# EAGLE design putt_project (EAGLE 9.6.2)
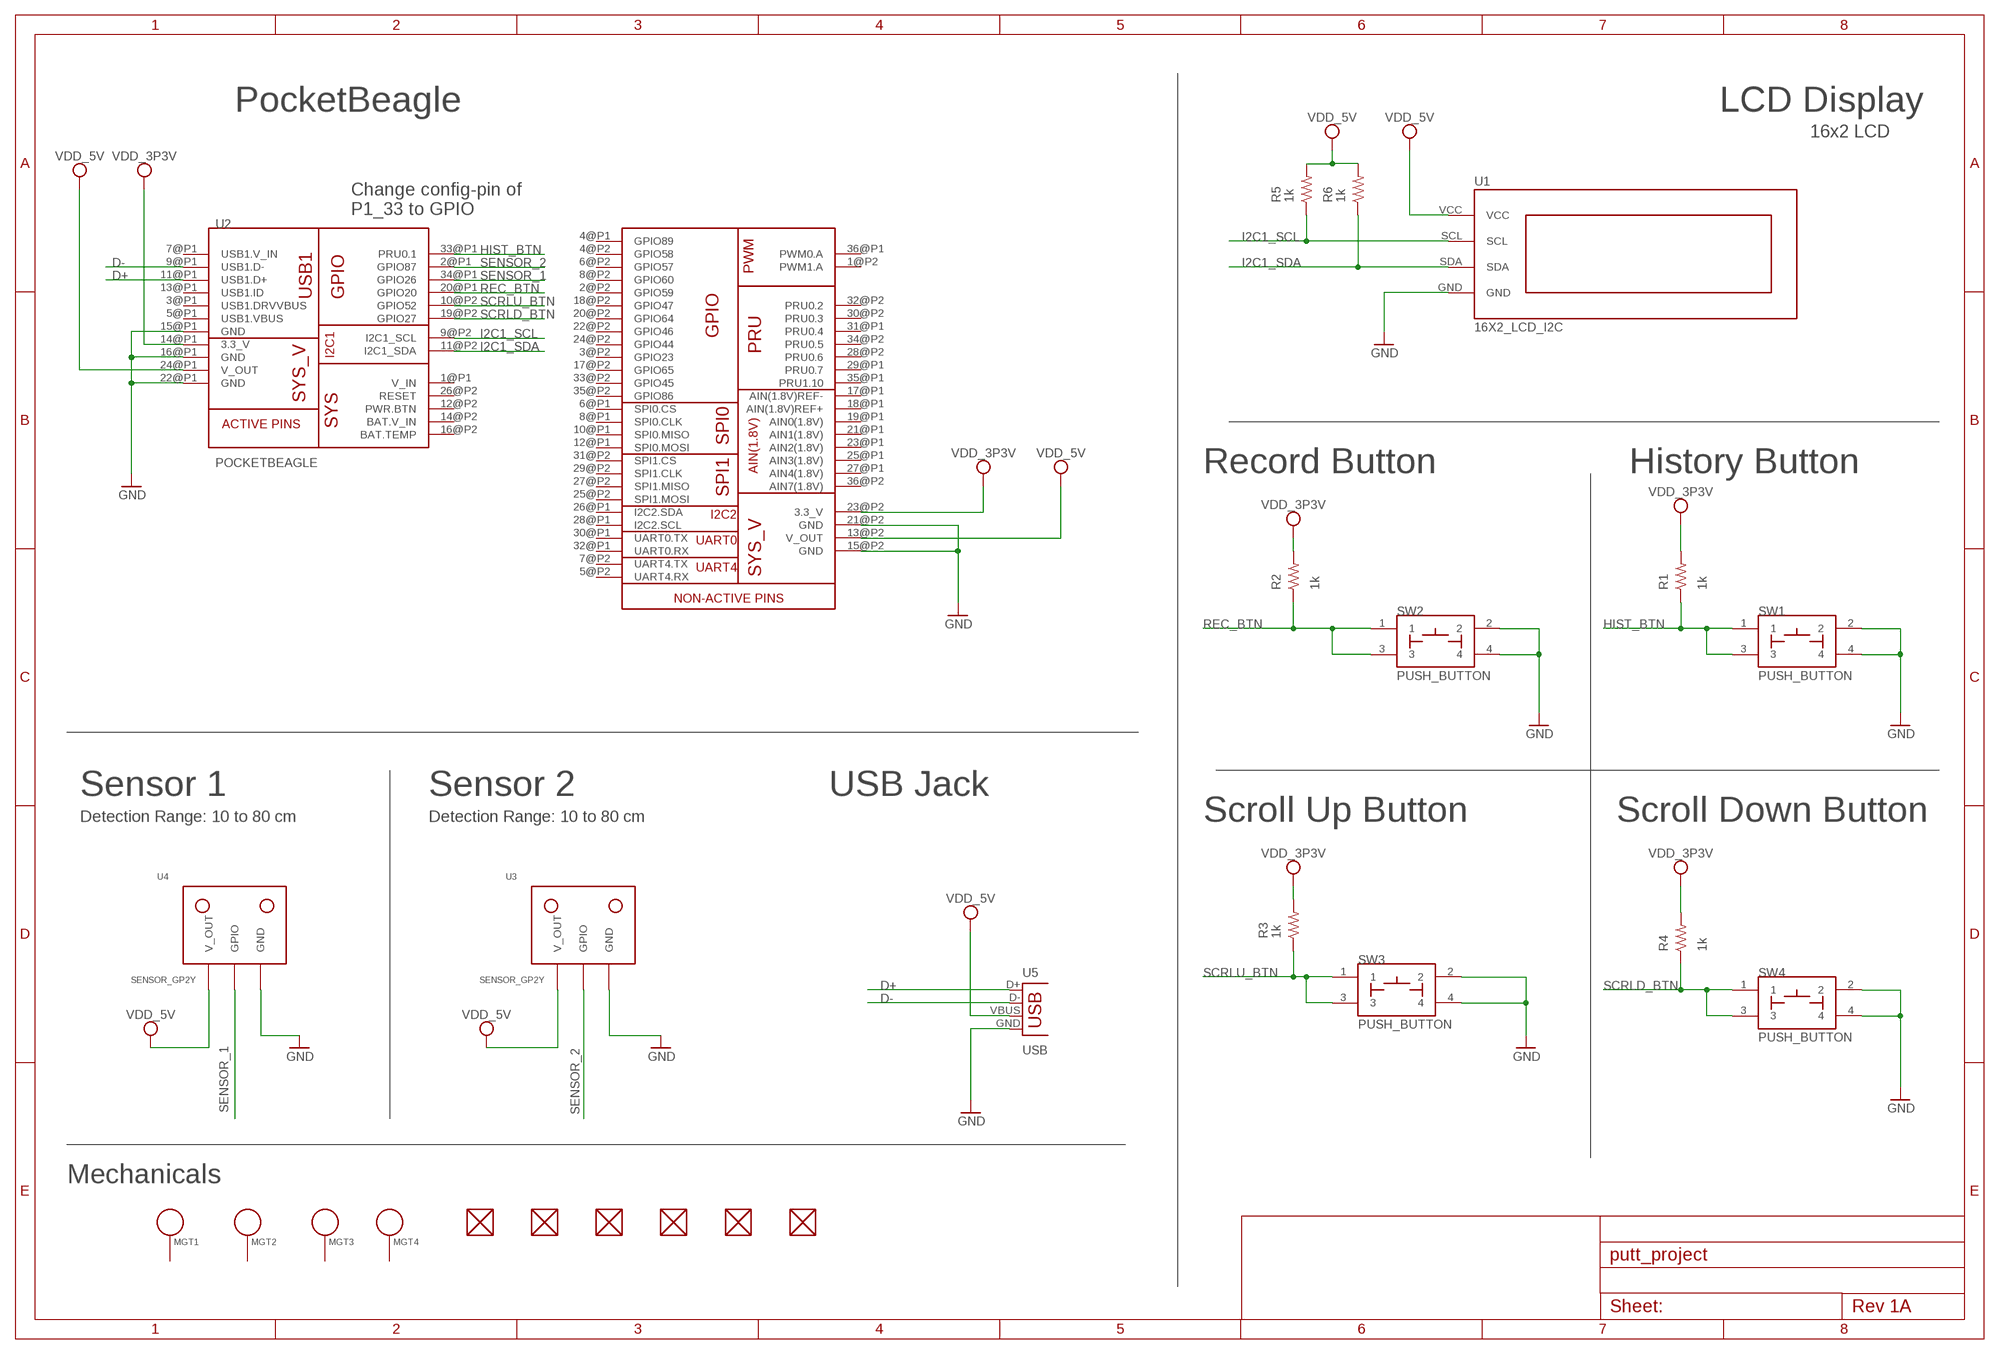
[diagram p0: schematic, sheet 1]

## Parts
FUD1  FIDUCIAL  [FIDUCIAL_40MIL]
FUD2  FIDUCIAL  [FIDUCIAL_40MIL]
FUD3  FIDUCIAL  [FIDUCIAL_40MIL]
FUD4  FIDUCIAL  [FIDUCIAL_40MIL]
FUD5  FIDUCIAL  [FIDUCIAL_40MIL]
FUD6  FIDUCIAL  [FIDUCIAL_40MIL]
MGT1  MOUNTING_HOLE  [MOUNTING_HOLE]
MGT2  MOUNTING_HOLE  [MOUNTING_HOLE]
MGT3  MOUNTING_HOLE  [MOUNTING_HOLE]
MGT4  MOUNTING_HOLE  [MOUNTING_HOLE]
R1  1k  R_R0603  [R0603]
R2  1k  R_R0603  [R0603]
R3  1k  R_R0603  [R0603]
R4  1k  R_R0603  [R0603]
R5  1k  R_R0603  [R0603]
R6  1k  R_R0603  [R0603]
SW1  PUSH_BUTTON  [BUTTON_12.5MM]
SW2  PUSH_BUTTON  [BUTTON_12.5MM]
SW3  PUSH_BUTTON  [BUTTON_12.5MM]
SW4  PUSH_BUTTON  [BUTTON_12.5MM]
U1  16X2_LCD_I2C  [16X2_LCD_I2C]
U2  POCKETBEAGLE  [POCKETBEAGLE]
U3  SENSOR_GP2Y  [SENSOR_IR]
U4  SENSOR_GP2Y  [SENSOR_IR]
U5  USB  [USB-A-H]

## Nets
D+: U2.11@P1(USB1.D+) U5.D+
D-: U2.9@P1(USB1.D-) U5.D-
GND: SW1.2 SW1.4 SW2.2 SW2.4 SW3.2 SW3.4 SW4.2 SW4.4 U1.GND U2.15@P1(GND) U2.15@P2(GND) U2.16@P1(GND) U2.21@P2(GND) U2.22@P1(GND) U3.GND U4.GND U5.GND
HIST_BTN: R1.1 SW1.1 SW1.3 U2.33@P1(PRU0.1)
I2C1_SCL: R5.1 U1.SCL U2.9@P2(I2C1_SCL)
I2C1_SDA: R6.1 U1.SDA U2.11@P2(I2C1_SDA)
REC_BTN: R2.1 SW2.1 SW2.3 U2.20@P1(GPIO20)
SCRLD_BTN: R4.1 SW4.1 SW4.3 U2.19@P2(GPIO27)
SCRLU_BTN: R3.1 SW3.1 SW3.3 U2.10@P2(GPIO52)
SENSOR_1: U2.34@P1(GPIO26) U4.GPIO
SENSOR_2: U2.2@P1(GPIO87) U3.GPIO
VDD_3P3V: R1.2 R2.2 R3.2 R4.2 U2.14@P1(3.3_V) U2.23@P2(3.3_V)
VDD_5V: R5.2 R6.2 U1.VCC U2.13@P2(V_OUT) U2.24@P1(V_OUT) U3.PWR(V_OUT) U4.PWR(V_OUT) U5.VBUS
Unconnected: FUD1.P$1 FUD2.P$1 FUD3.P$1 FUD4.P$1 FUD5.P$1 FUD6.P$1 MGT1.P$1 MGT2.P$1 MGT3.P$1 MGT4.P$1 U2.1@P1(V_IN) U2.1@P2(PWM1.A) U2.2@P2(GPIO59) U2.3@P1(USB1.DRVVBUS) U2.3@P2(GPIO23) U2.4@P1(GPIO89) U2.4@P2(GPIO58) U2.5@P1(USB1.VBUS) U2.5@P2(UART4.RX) U2.6@P1(SPI0.CS) U2.6@P2(GPIO57) U2.7@P1(USB1.V_IN) U2.7@P2(UART4.TX) U2.8@P1(SPI0.CLK) U2.8@P2(GPIO60) U2.10@P1(SPI0.MISO) U2.12@P1(SPI0.MOSI) U2.12@P2(PWR.BTN) U2.13@P1(USB1.ID) U2.14@P2(BAT.V_IN) U2.16@P2(BAT.TEMP) U2.17@P1(AIN(1.8V)REF-) U2.17@P2(GPIO65) U2.18@P1(AIN(1.8V)REF+) U2.18@P2(GPIO47) U2.19@P1(AIN0(1.8V)) U2.20@P2(GPIO64) U2.21@P1(AIN1(1.8V)) U2.22@P2(GPIO46) U2.23@P1(AIN2(1.8V)) U2.24@P2(GPIO44) U2.25@P1(AIN3(1.8V)) U2.25@P2(SPI1.MOSI) U2.26@P1(I2C2.SDA) U2.26@P2(RESET) U2.27@P1(AIN4(1.8V)) U2.27@P2(SPI1.MISO) U2.28@P1(I2C2.SCL) U2.28@P2(PRU0.6) U2.29@P1(PRU0.7) U2.29@P2(SPI1.CLK) U2.30@P1(UART0.TX) U2.30@P2(PRU0.3) U2.31@P1(PRU0.4) U2.31@P2(SPI1.CS) U2.32@P1(UART0.RX) U2.32@P2(PRU0.2) U2.33@P2(GPIO45) U2.34@P2(PRU0.5) U2.35@P1(PRU1.10) U2.35@P2(GPIO86) U2.36@P1(PWM0.A) U2.36@P2(AIN7(1.8V))

## Notes on the sheet
- PocketBeagle | LCD Display
- 16x2 LCD
- Change config-pin of 
  P1_33 to GPIO
- Record Button | History Button
- Sensor 1 | Sensor 2 | USB Jack
- Detection Range: 10 to 80 cm | Detection Range: 10 to 80 cm | Scroll Up Button | Scroll Down Button
- U5
- USB
- Mechanicals

## Library data of the parts
FUD1-FUD6 = Putt_Project:FIDUCIAL
MGT1-MGT4 = Putt_Project:MOUNTING_HOLE: Chassis Mounting Hole w/GND connection ability
R1-R6 = Putt_Project:R_: RESISTOR, American symbol
SW1-SW4 = Putt_Project:PUSH_BUTTON
U1 = Putt_Project:16X2_LCD_I2C: 0.56" LED HEX Backback - Adafruit HT16K33 - https://www.adafruit.com/product/878 - https://www.adafruit.com/product/879 - https://www.adafruit.com/product/880 - https://www.adafruit.com/product/881 - https://www.adafruit.com/product/1002
U2 = Putt_Project:POCKETBEAGLE
U3 U4 = Putt_Project:SENSOR_GP2Y
U5 = Putt_Project:USB

## Board
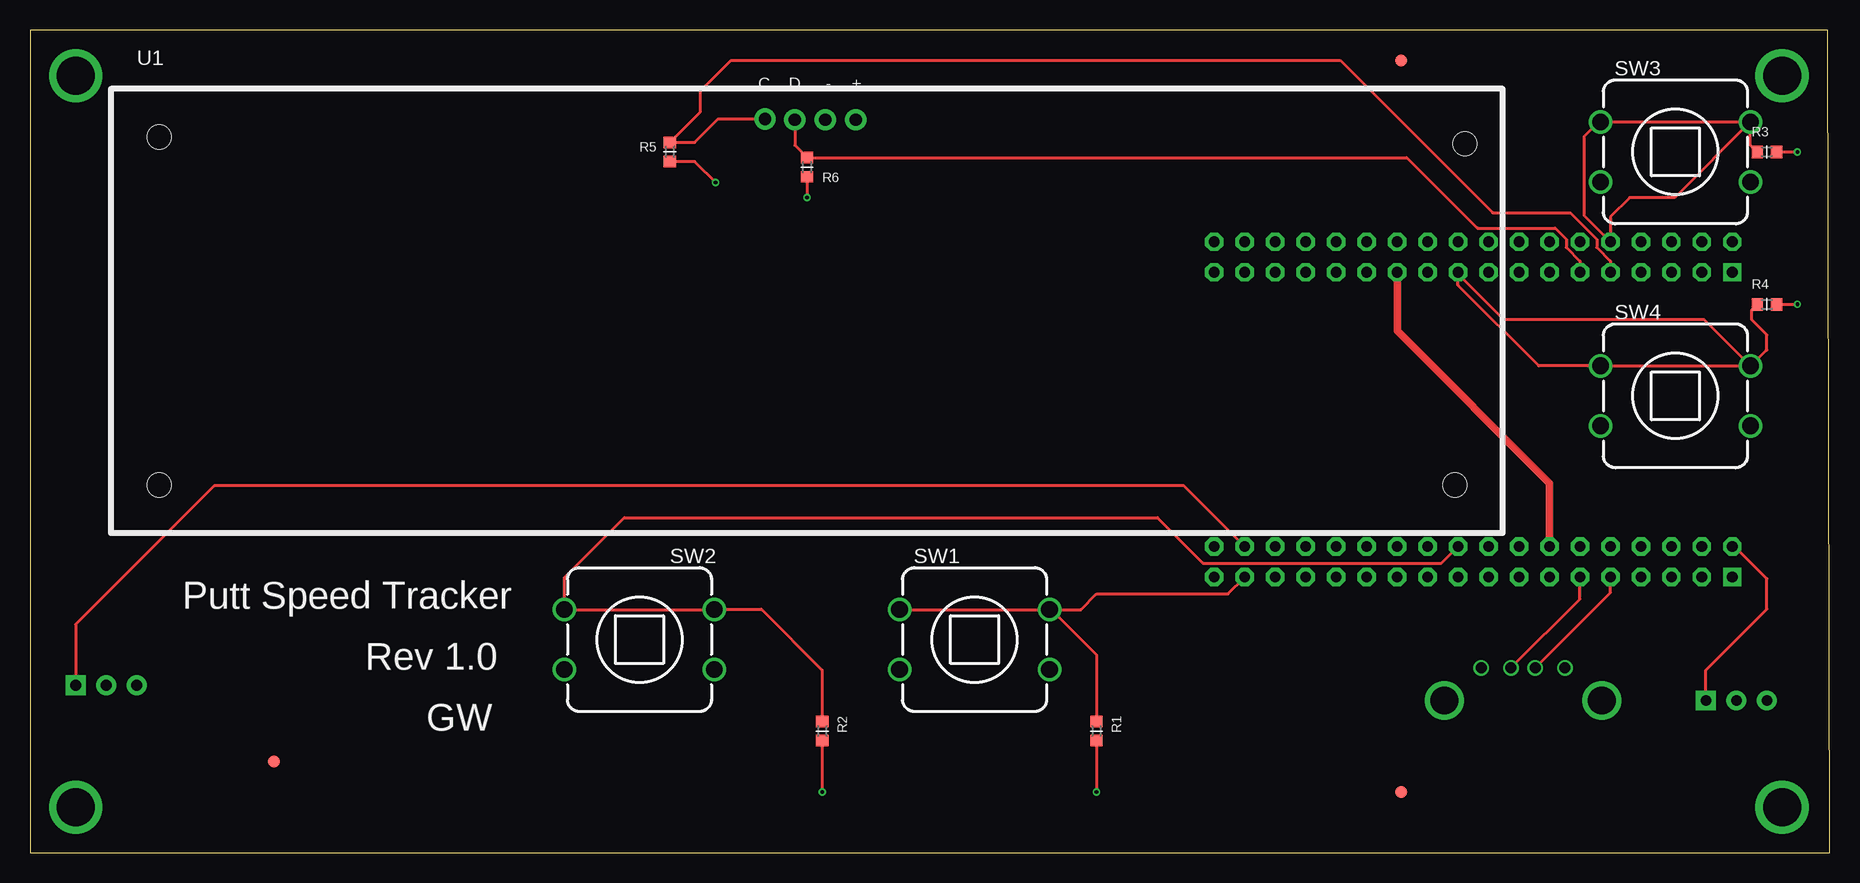
[diagram p1: board, top side]
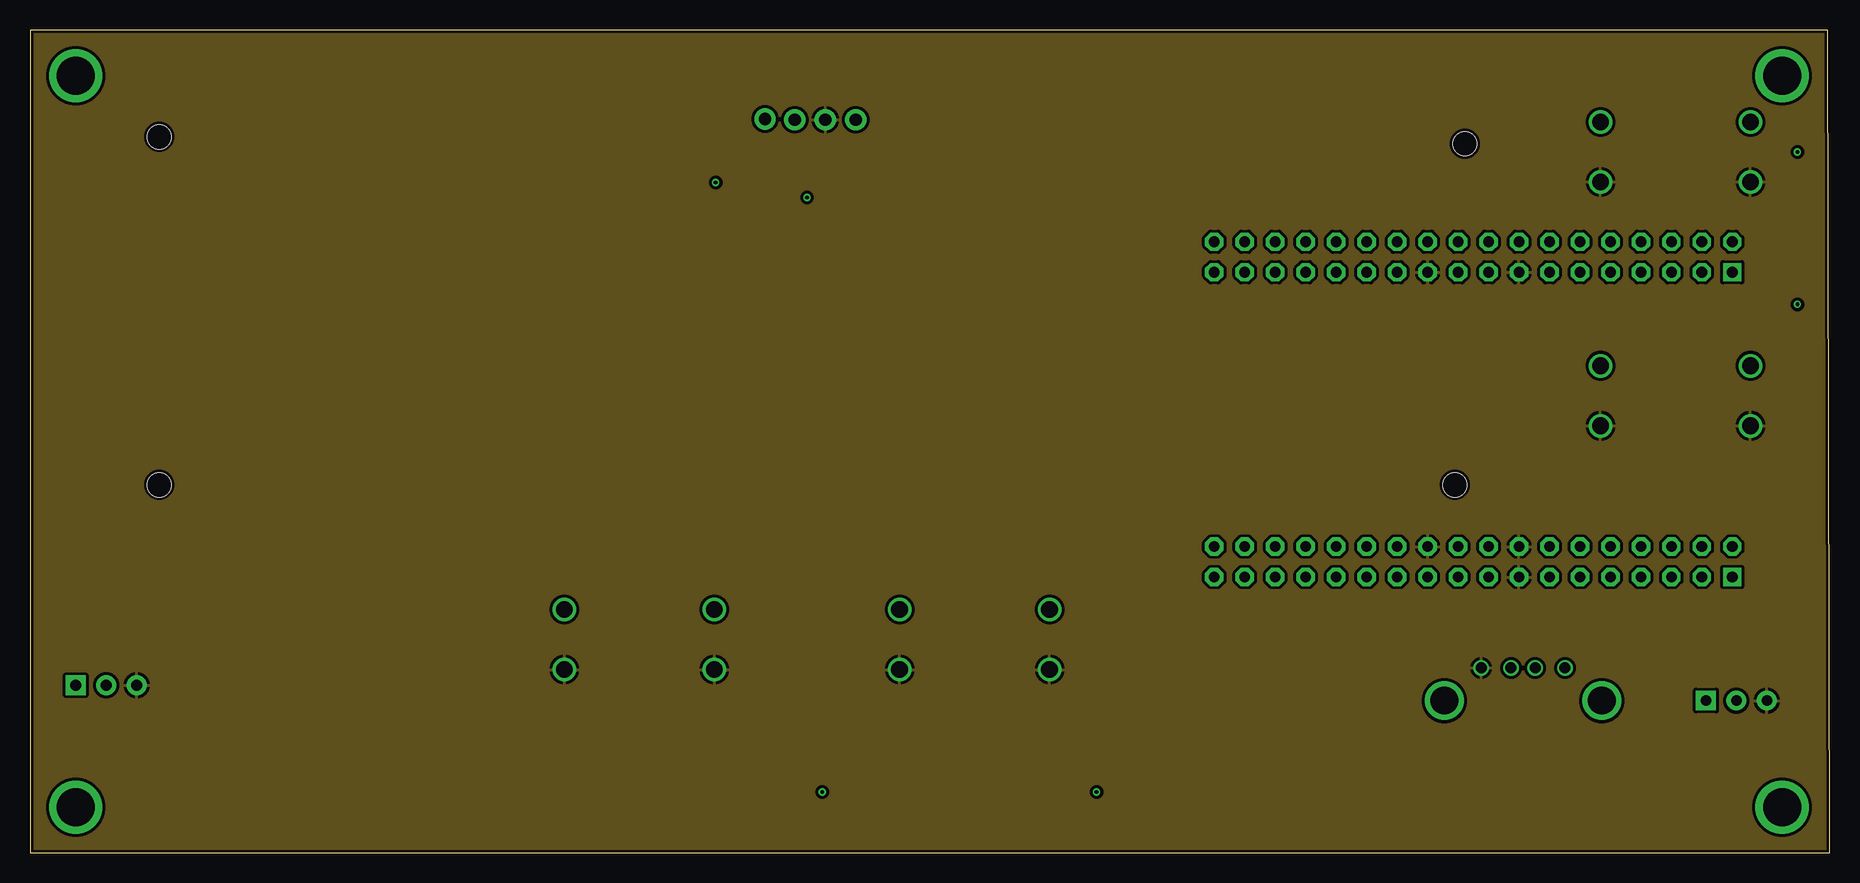
[diagram p2: board, inner layer Route2]
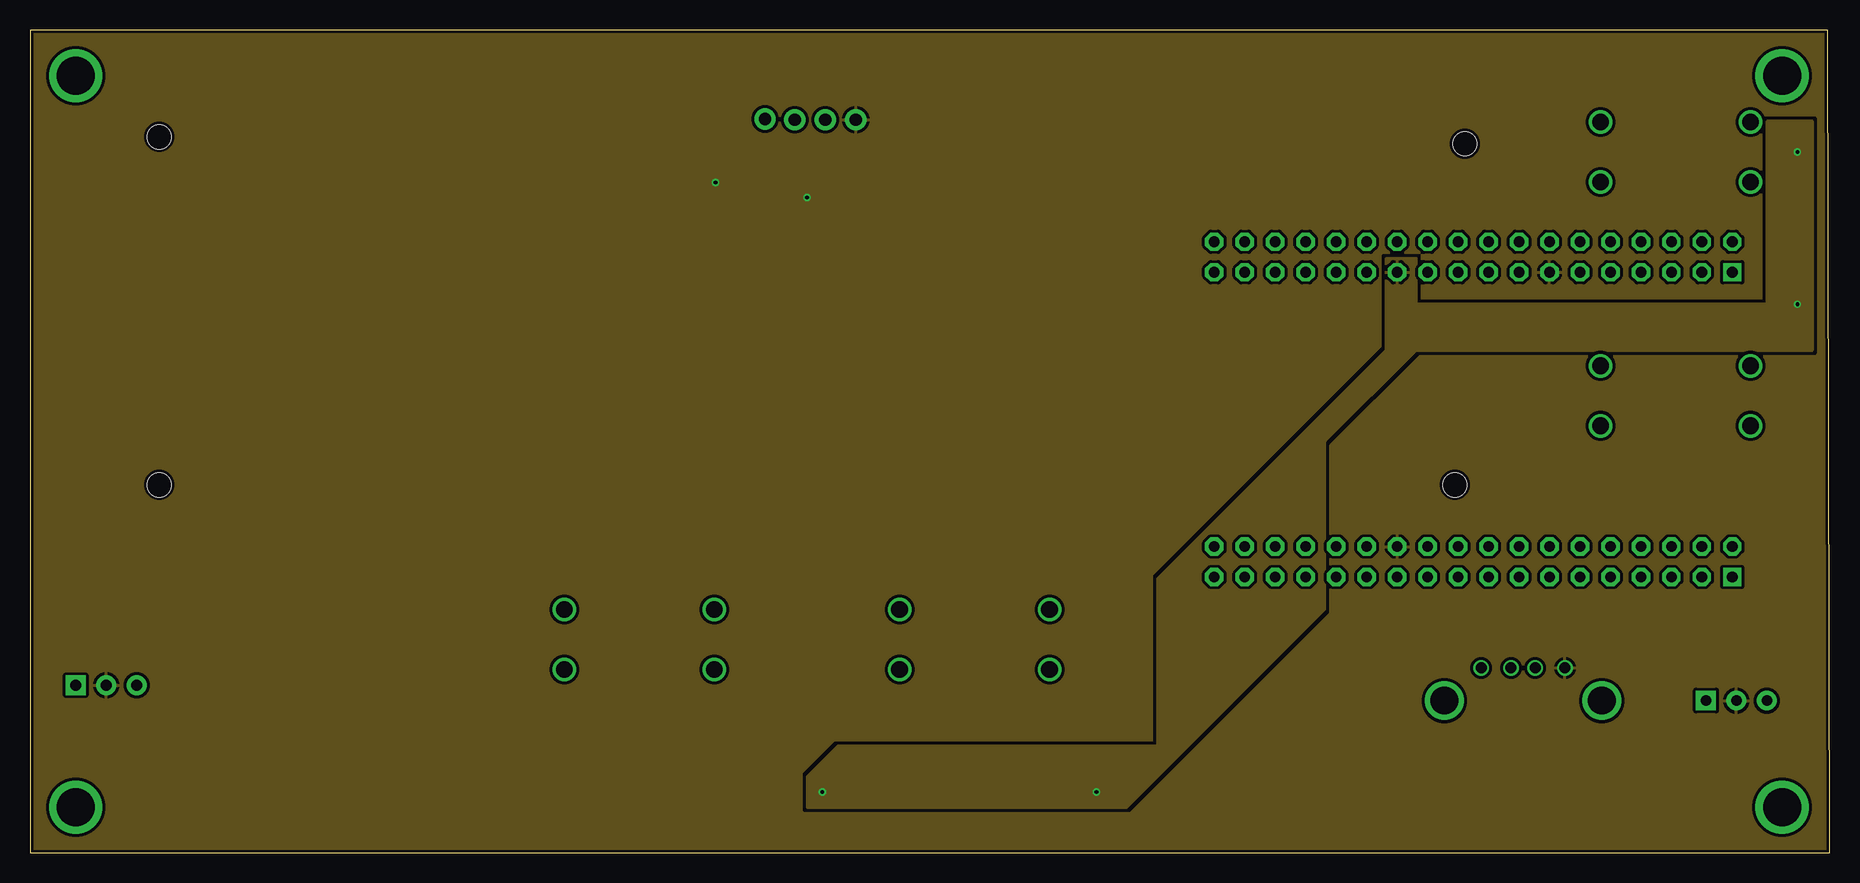
[diagram p3: board, inner layer Route15]
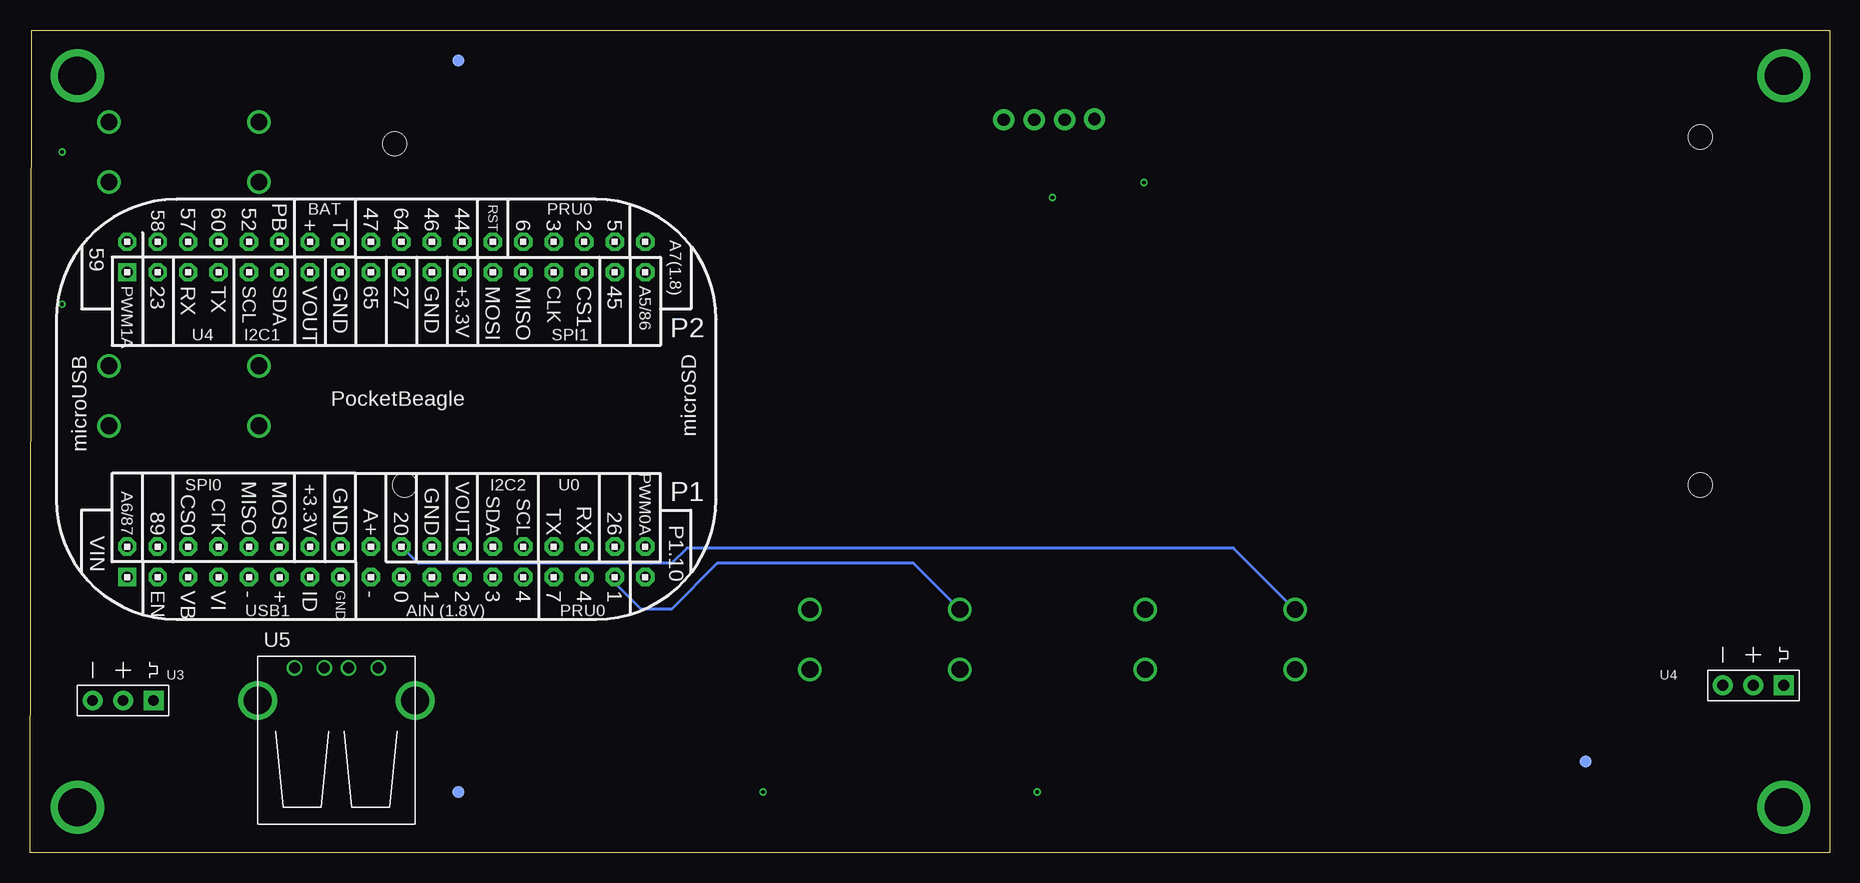
[diagram p4: board, bottom side, seen from below]

Size 150 x 68.58 mm. Coordinates in mm from the lower left corner, seen from the top.
Outline: 0,0 150,0 149.86,68.58 0,68.58 0,0
Copper layers (1*2*15*16): Top 0.035mm / dielectric 0.23mm / Route2 0.035mm / dielectric 0.93mm / Route15 0.035mm / dielectric 0.23mm / Bottom 0.035mm
Design rules "ENGI301_4lyr": minimum track width 10mil, minimum drill 12mil, track to track 10mil, track to pad 10mil, pad to pad 10mil, via to via 10mil, smd to smd 10mil, copper to edge 10mil, drill to drill 12mil, minimum pad ring 6mil, minimum via ring 6mil, stop-mask expansion 3mil, vias tented up to drill 25mil, thermal gap 10mil

### Footprints (pad centres in the part's own frame; a part is rotated, then mirrored left to right if it is on the bottom)
FIDUCIAL_40MIL = smd 1.016 x 1.016: P$1 0,0
MOUNTING_HOLE = drill 3.175 pad 4.445: P$1 0,0
R0603 = smd 0.95 x 1.031: 1 -0.8,0; 2 0.8,0
BUTTON_12.5MM = drill 1.4: 1 -6.25,2.5; 2 -6.25,-2.5; 3 6.25,2.5; 4 6.25,-2.5
16X2_LCD_I2C = drill 1.016 pad 1.778: GND 1.524,34.43; SCL -3.5,34.5; SDA -1.016,34.43; VCC 4.064,34.43 | hole 2: -54,4; 54,4; -54,33; 54.844,32.43
POCKETBEAGLE = drill 0.889 pad 1.524 square: 1@P1 5.91,3.53; 1@P2 5.91,28.93 | drill 0.889 pad 1.524 octagon: 2@P1 5.91,6.07; 2@P2 5.91,31.47; 3@P1 8.45,3.53; 3@P2 8.45,28.93; 4@P1 8.45,6.07; 4@P2 8.45,31.47; 5@P1 10.99,3.53; 5@P2 10.99,28.93; 6@P1 10.99,6.07; 6@P2 10.99,31.47; 7@P1 13.53,3.53; 7@P2 13.53,28.93; 8@P1 13.53,6.07; 8@P2 13.53,31.47; 9@P1 16.07,3.53; 9@P2 16.07,28.93; 10@P1 16.07,6.07; 10@P2 16.07,31.47; 11@P1 18.61,3.53; 11@P2 18.61,28.93; 12@P1 18.61,6.07; 12@P2 18.61,31.47; 13@P1 21.15,3.53; 13@P2 21.15,28.93; 14@P1 21.15,6.07; 14@P2 21.15,31.47; 15@P1 23.69,3.53; 15@P2 23.69,28.93; 16@P1 23.69,6.07; 16@P2 23.69,31.47; 17@P1 26.23,3.53; 17@P2 26.23,28.93; 18@P1 26.23,6.07; 18@P2 26.23,31.47; 19@P1 28.77,3.53; 19@P2 28.77,28.93; 20@P1 28.77,6.07; 20@P2 28.77,31.47; 21@P1 31.31,3.53; 21@P2 31.31,28.93; 22@P1 31.31,6.07; 22@P2 31.31,31.47; 23@P1 33.85,3.53; 23@P2 33.85,28.93; 24@P1 33.85,6.07; 24@P2 33.85,31.47; 25@P1 36.39,3.53; 25@P2 36.39,28.93; 26@P1 36.39,6.07; 26@P2 36.39,31.47; 27@P1 38.93,3.53; 27@P2 38.93,28.93; 28@P1 38.93,6.07; 28@P2 38.93,31.47; 29@P1 41.47,3.53; 29@P2 41.47,28.93; 30@P1 41.47,6.07; 30@P2 41.47,31.47; 31@P1 44.01,3.53; 31@P2 44.01,28.93; 32@P1 44.01,6.07; 32@P2 44.01,31.47; 33@P1 46.55,3.53; 33@P2 46.55,28.93; 34@P1 46.55,6.07; 34@P2 46.55,31.47; 35@P1 49.09,3.53; 35@P2 49.09,28.93; 36@P1 49.09,6.07; 36@P2 49.09,31.47
SENSOR_IR = drill 0.889 pad 1.651: GND 0,-2.54; PWR 0,0 | drill 0.889 pad 1.651 square: GPIO 0,2.54
USB-A-H = drill 0.914: D+ 2.718,-1.003; D- 2.718,1.003; GND 2.718,-3.493; VBUS 2.718,3.493 | drill 2.311: P$5 0,-6.566; P$6 0,6.566

### Placement (x,y rotation side)
FUD1  20.32,7.62 0 top
FUD2  114.3,5.08 0 top
FUD3  114.3,66.04 0 top
FUD4  20.32,7.62 0 bottom
FUD5  114.3,5.08 0 bottom
FUD6  114.3,66.04 0 bottom
MGT1  3.81,3.81 0 top
MGT2  146.05,3.81 0 top
MGT3  3.81,64.77 0 top
MGT4  146.05,64.77 0 top
R1  88.9,10.16 270 top
R2  66.04,10.16 270 top
R3  144.78,58.42 0 top
R4  144.78,45.72 0 top
R5  53.34,58.42 270 top
R6  64.77,57.15 270 top
SW1  78.74,17.78 0 top
SW2  50.8,17.78 0 top
SW3  137.16,58.42 0 top
SW4  137.16,38.1 0 top
U1  64.77,26.67 0 top
U2  147.81,19.46 0 bottom
U3  142.24,12.7 270 bottom
U4  6.35,13.97 270 bottom
U5  124.46,12.7 90 bottom

### Tracks (layer width: path | path; a pad name or v marks a point on that pad's centre or on a via)
D+
  Top 0.254: U5.D+ 129.2,21.16 U2.11@P1
D-
  Top 0.254: U5.D- 131.74,21.7 U2.9@P1
GND
  pour Route2: -2.54,71.12 -2.54,-2.54 152.4,-2.54 152.4,71.12
HIST_BTN
  Top 0.254: SW1.3 85.13,20.28 88.9,16.51 R1.1 | SW1.1 SW1.3 | SW1.3 87.59,20.28 88.9,21.59 99.86,21.59 U2.33@P1
  Bottom 0.254: SW1.1 76.34,24.13 92.71,24.13 96.52,20.32 99.06,20.32 101.26,22.52 U2.33@P1
I2C1_SCL
  Top 0.254: U1.SCL 57.36,61.17 55.41,59.22 R5.1 55.88,61.76 55.88,63.5 58.42,66.04 109.22,66.04 121.92,53.34 128.41,53.34 130.6,51.15 130.6,50.46 131.74,49.31 U2.9@P2
I2C1_SDA
  Top 0.254: U1.SDA 63.75,58.97 R6.1 114.77,57.95 120.65,52.07 127.13,52.07 128.06,51.15 128.06,50.46 129.2,49.31 U2.11@P2
REC_BTN
  Top 0.254: R2.1 66.04,15.24 60.96,20.32 57.09,20.32 SW2.3 SW2.1 44.55,22.96 49.53,27.94 93.98,27.94 97.79,24.13 98.24,24.13 98.25,24.13 117.64,24.13 U2.20@P1
  Bottom 0.254: SW2.1 49.67,25.4 95.25,25.4 96.52,24.13 98.24,24.13 98.25,24.13 117.64,24.13 U2.20@P1
SCRLD_BTN
  Top 0.254: SW4.3 SW4.1 125.77,40.6 119.04,47.33 119.04,48.26 | SW4.3 144.72,41.91 144.78,41.91 144.78,43.18 143.51,44.45 143.51,45.25 R4.1 | 119.04,48.26 U2.19@P2 | SW4.3 139.56,44.45 122.85,44.45 119.04,48.26
SCRLU_BTN
  Top 0.254: SW3.3 SW3.1 130.77,60.92 129.54,59.69 129.54,53.13 U2.10@P2 131.74,53 133.35,54.61 137.1,54.61 SW3.3 | SW3.3 143.51,61.02 | R3.1 143.41,58.99 SW3.3
SENSOR_1
  Top 0.254: U2.34@P1 96.18,30.61 15.37,30.61 3.81,19.05 U4.GPIO
SENSOR_2
  Top 0.254: U3.GPIO 139.7,15.24 144.78,20.32 144.78,22.86 142.11,25.53 U2.2@P1
VDD_3P3V  (via drill 0.3 pad 0.61)
  Top 0.254: R2.2 v66.04,5.08 | R1.2 v88.9,5.08 | R4.2 v147.32,45.72 | R3.2 v147.32,58.42
  Top 0.61: U2.14@P1 126.66,30.82 113.96,43.52 U2.23@P2
  pour Route15: 64.77,6.35 64.77,3.81 91.44,3.81 107.95,20.32 107.95,34.29 115.57,41.91 148.59,41.91 148.59,60.96 144.78,60.96 144.78,45.72 115.57,45.72 115.57,49.53 113.03,49.53 113.03,41.91 93.98,22.86 93.98,8.89 67.31,8.89
VDD_5V  (via drill 0.3 pad 0.61)
  Top 0.254: v57.15,55.88 55.41,57.62 R5.2 | R6.2 v64.77,54.61
  pour Route15 (rank 2): -5.08,73.66 -5.08,-5.08 154.94,-5.08 154.94,73.66

### Text on the board
tPlace: Putt Speed Tracker | Rev 1.0 | GW